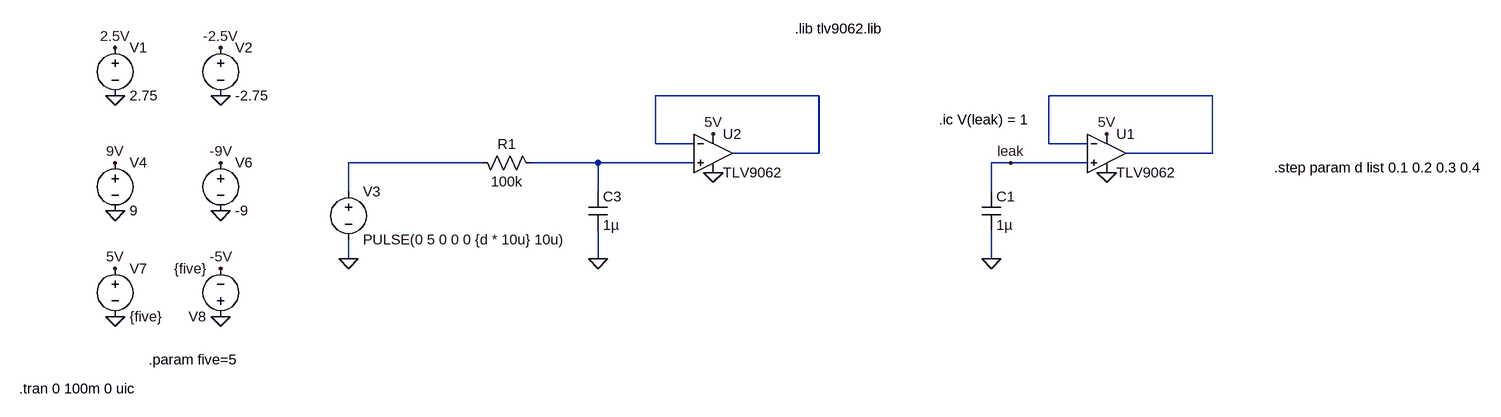
[diagram p0: schematic 201_pwm_buffer.asc]
201_pwm_buffer.asc, the LTspice schematic file:
Version 4
SHEET 1 4180 1640
WIRE 176 -192 -96 -192
WIRE 832 -192 560 -192
WIRE -96 -112 -96 -192
WIRE -32 -112 -96 -112
WIRE 560 -112 560 -192
WIRE 624 -112 560 -112
WIRE 176 -96 176 -192
WIRE 176 -96 32 -96
WIRE 832 -96 832 -192
WIRE 832 -96 688 -96
WIRE -384 -80 -608 -80
WIRE -192 -80 -304 -80
WIRE -32 -80 -192 -80
WIRE 496 -80 464 -80
WIRE 624 -80 496 -80
WIRE -608 -32 -608 -80
WIRE -192 -32 -192 -80
WIRE 464 -32 464 -80
WIRE -608 80 -608 48
WIRE -192 80 -192 32
WIRE 464 80 464 32
FLAG -1312 -192 0
FLAG -1312 -272 2.5V
FLAG -1136 -192 0
FLAG -1136 -272 -2.5V
FLAG -1312 0 0
FLAG -1312 -80 9V
FLAG -1136 0 0
FLAG -1136 -80 -9V
FLAG -1312 176 0
FLAG -1312 96 5V
FLAG -1136 176 0
FLAG -1136 96 -5V
FLAG -192 80 0
FLAG -608 80 0
FLAG 0 -128 5V
FLAG 0 -64 0
FLAG 464 80 0
FLAG 656 -128 5V
FLAG 656 -64 0
FLAG 496 -80 leak
SYMBOL voltage -1312 -288 R0
SYMATTR InstName V1
SYMATTR Value 2.75
SYMBOL voltage -1136 -288 R0
SYMATTR InstName V2
SYMATTR Value -2.75
SYMBOL voltage -1312 -96 R0
SYMATTR InstName V4
SYMATTR Value 9
SYMBOL voltage -1136 -96 R0
SYMATTR InstName V6
SYMATTR Value -9
SYMBOL voltage -1312 80 R0
SYMATTR InstName V7
SYMATTR Value {five}
SYMBOL voltage -1136 192 R180
WINDOW 123 0 0 Left 0
WINDOW 39 0 0 Left 0
SYMATTR InstName V8
SYMATTR Value {five}
SYMBOL OpAmps\\opamp2 0 -160 R0
SYMATTR InstName U2
SYMATTR Value TLV9062
SYMBOL res -400 -96 M90
WINDOW 0 0 56 VBottom 2
WINDOW 3 32 56 VTop 2
SYMATTR InstName R1
SYMATTR Value 100k
SYMBOL cap -208 -32 R0
SYMATTR InstName C3
SYMATTR Value 1µ
SYMBOL voltage -608 -48 R0
WINDOW 123 0 0 Left 0
WINDOW 39 0 0 Left 0
SYMATTR InstName V3
SYMATTR Value PULSE(0 5 0 0 0 {d * 10u} 10u)
SYMBOL OpAmps\\opamp2 656 -160 R0
SYMATTR InstName U1
SYMATTR Value TLV9062
SYMBOL cap 448 -32 R0
SYMATTR InstName C1
SYMATTR Value 1µ
TEXT -1472 296 Left 2 !.tran 0 100m 0 uic
TEXT -1256 248 Left 2 !.param five=5
TEXT 1472 -72 Left 2 !.step param d list 0.1 0.2 0.3 0.4
TEXT 136 -304 Left 2 !.lib tlv9062.lib
TEXT 376 -152 Left 2 !.ic V(leak) = 1

The netlist it stands for:
* 201_pwm_buffer.asc
V1 2.5V 0 2.75
V2 -2.5V 0 -2.75
V4 9V 0 9
V6 -9V 0 -9
V7 5V 0 {five}
V8 0 -5V {five}
XU2 N004 N001 5V 0 N001 TLV9062  ; pins In+ In- V+ V- OUT
R1 N003 N004 100k
C3 N004 0 1µ
V3 N003 0 PULSE(0 5 0 0 0 {d * 10u} 10u)
XU1 leak N002 5V 0 N002 TLV9062  ; pins In+ In- V+ V- OUT
C1 leak 0 1µ
.tran 0 100m 0 uic
.param five=5
.step param d list 0.1 0.2 0.3 0.4
.lib tlv9062.lib
.ic V(leak) = 1
.backanno
.end